# Altium project The_real_mainboar.PrjPcb
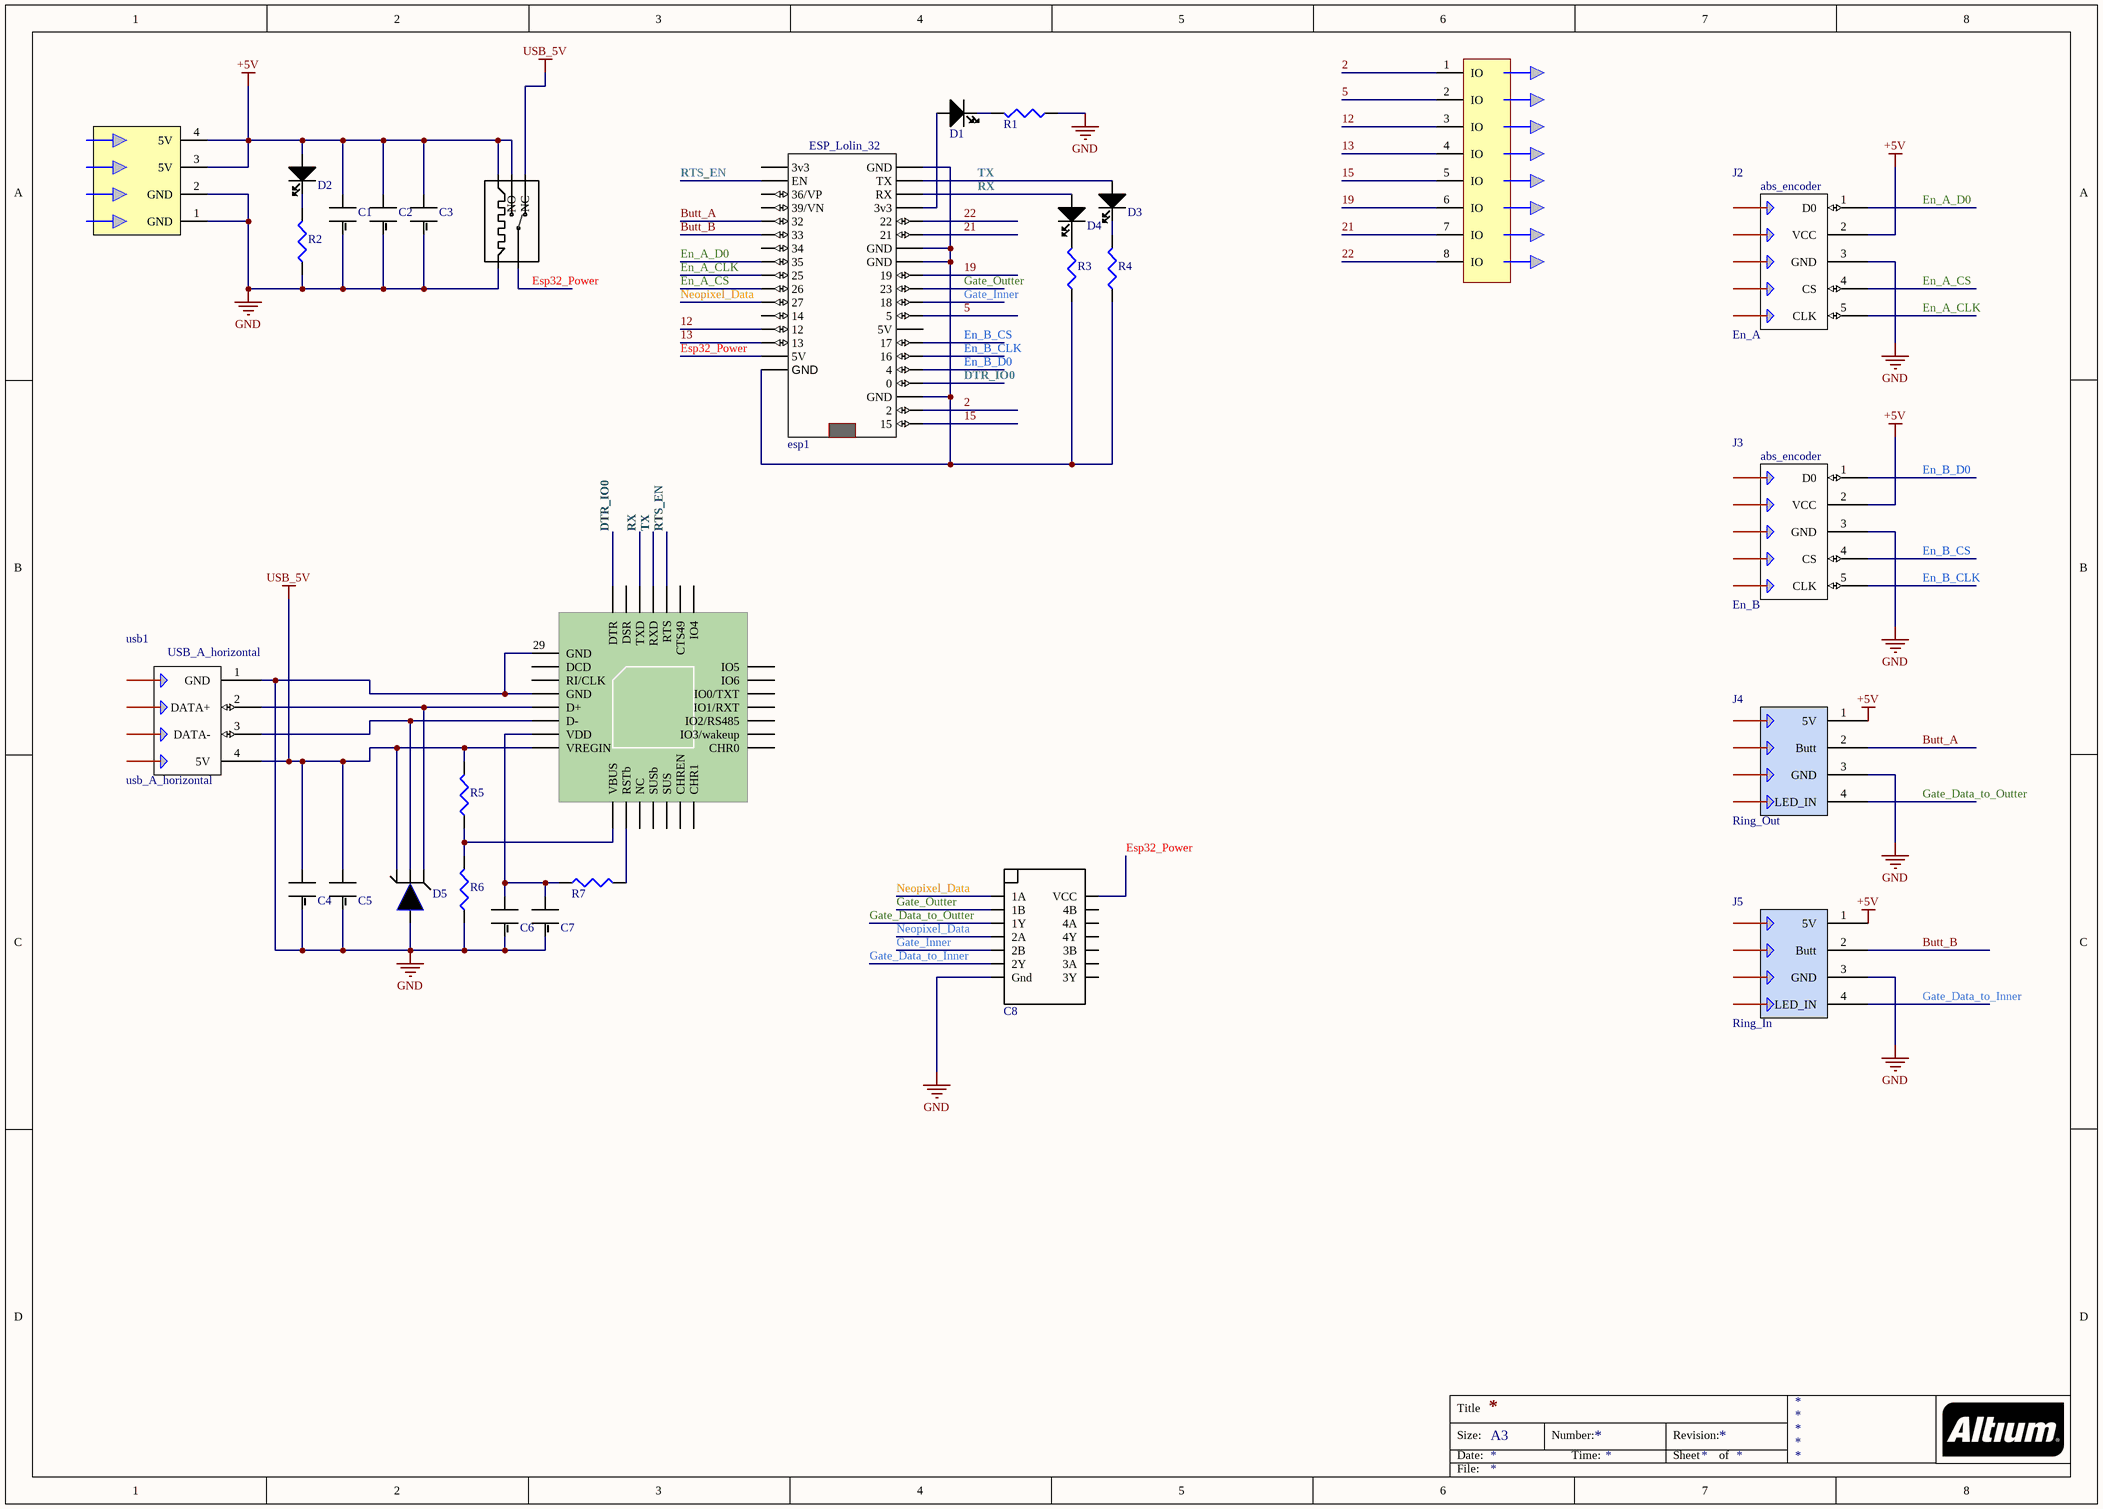
[diagram p0: TheRealMainboardSCH.SchDoc]
1 sheet, 30 parts. Net scope: global (net labels, ports and power ports of the same name join across sheets).
Board file: TheRealMainboardPCB.PcbDoc

## Sheet TheRealMainboardSCH.SchDoc
size A3

### Parts
C1  EEU-FM0J331  [2.5mmCapacitor]  (value not drawn)
C2  EEU-FM0J331  [2.5mmCapacitor]  (value not drawn)
C3  EEU-FM0J331  [2.5mmCapacitor]  (value not drawn)
C4  C4R7  [Capacitor0603]  (value not drawn)
C5  C104  [Capacitor0603]  (value not drawn)
C6  C104  [Capacitor0603]  (value not drawn)
C7  C4R7  [Capacitor0603]  (value not drawn)
C8  74hc08d  [SOP14(74hc08d)]  (value not drawn)
cp1  CP2102N  [CP2102N_QFN28]  (value not drawn)
D1  ESP  [LED0603]  (value not drawn)
D2  P_on  [LED0603]  (value not drawn)
D3  TXD  [LED0603]  (value not drawn)
D4  RXD  [LED0603]  (value not drawn)
D5  SP0503BAHTG  [SP0503BAHTG - SOT143-4]  (value not drawn)
esp1  processor  [ESP_32_socket]  (value not drawn)
J1  4.2mm 4pin 39300040  [4.2mm 4pos]  (value not drawn)
J2  En_A  [xh 2.54 5 pin]
J3  En_B  [xh 2.54 5 pin]
J4  Ring_Out  [XH 2.54 4 PIN]
J5  Ring_In  [XH 2.54 4 PIN]
j6  1x8 dupont io pins  [1x8 dupont]  (value not drawn)
R1  360R  [R0805]  (value not drawn)
R2  R360  [R0805]  (value not drawn)
R3  R360  [R0805]  (value not drawn)
R4  R360  [R0805]  (value not drawn)
R5  R2212  [R0805]  (value not drawn)
R6  R4752  [R0805]  (value not drawn)
R7  R102  [R0805]  (value not drawn)
Relay1  Omron_G5v_dc5  [G5v1_5vdc]  (value not drawn)
usb1  usb_A_horizontal  [HORIZONTAL_USB_A_MALE_SOCKET]

### Nets
+5V: C1.2(+) C2.2(+) C3.2(+) D2.2 J1.3(5V) J1.4(5V) J2.2(VCC) J3.2(VCC) J4.1(5V) J5.1(5V) Relay1.1(Coli_A) Relay1.5(NO)
GND: C1.1(-) C2.1(-) C3.1(-) C4.1(-) C5.1(-) C6.1(-) C7.1(-) C8.7(Gnd) cp1.3(GND) cp1.29(GND) D5.1(+) J1.1(GND) J1.2(GND) J2.3(GND) J3.3(GND) J4.3(GND) J5.3(GND) R1.1 R2.1 R6.1 Relay1.2(Coli_B) usb1.1(GND)
USB_5V: C4.2(+) C5.2(+) cp1.7(VREGIN) D5.4 R5.2 Relay1.4(NC) usb1.4(5V)
2: esp1.19(2) j6.1(IO)
5: esp1.12(5) j6.2(IO)
12: esp1.33(12) j6.3(IO)
13: esp1.34(13) j6.4(IO)
15: esp1.20(15) j6.5(IO)
19: esp1.9(19) j6.6(IO)
21: esp1.6(21) j6.7(IO)
22: esp1.5(22) j6.8(IO)
Butt_A: esp1.25(32) J4.2(Butt)
Butt_B: esp1.26(33) J5.2(Butt)
DTR_IO0: cp1.28(DTR) esp1.17(0)
En_A_CLK: esp1.29(25) J2.5(CLK)
En_A_CS: esp1.30(26) J2.4(CS)
En_A_D0: esp1.28(35) J2.1(D0)
En_B_CLK: esp1.15(16) J3.5(CLK)
En_B_CS: esp1.14(17) J3.4(CS)
En_B_D0: esp1.16(4) J3.1(D0)
Esp32_Power: C8.14(VCC) esp1.35(5V) Relay1.3(COM)
Gate_Data_to_Inner: C8.6(2Y) J5.4(LED_IN)
Gate_Data_to_Outter: C8.3(1Y) J4.4(LED_IN)
Gate_Inner: C8.5(2B) esp1.11(18)
Gate_Outter: C8.2(1B) esp1.10(23)
Neopixel_Data: C8.1(1A) C8.4(2A) esp1.31(27)
RTS_EN: cp1.24(RTS) esp1.22(EN)
RX: cp1.26(TXD) D4.2 esp1.3(RX)
TX: cp1.25(RXD) D3.2 esp1.2(TX)
NetC6_2: C6.2(+) C7.2(+) cp1.6(VDD) R7.1
Netcp1_4: cp1.4(D+) D5.2 usb1.2(DATA+)
Netcp1_5: cp1.5(D-) D5.3 usb1.3(DATA-)
Netcp1_8: cp1.8(VBUS) R5.1 R6.2
Netcp1_9: cp1.9(RSTb) R7.2
NetD1_1: D1.1 R1.2
NetD1_2: D1.2 esp1.4(3v3)
NetD2_1: D2.1 R2.2
NetD3_1: D3.1 R4.2
NetD4_1: D4.1 R3.2
Netesp1_1: esp1.1(GND) esp1.7(GND) esp1.8(GND) esp1.18(GND) esp1.36(GND) R3.1 R4.1

Not connected (* = marked no-connect by the designer): C8 8(3Y) 9(3A) 10(3B) 11(4Y) 12(4A) 13(4B); cp1 1(DCD) 2(RI/CLK) 10(NC) 11(SUSb) 12(SUS) 13(CHREN) 14(CHR1) 15(CHR0) 16(IO3/wakeup) 17(IO2/RS485) 18(IO1/RXT) 19(IO0/TXT) 20(IO6) 21(IO5) 22(IO4) 23(CTS49) 27(DSR); esp1 13(5V) 21(3v3) 23(36/VP) 24(39/VN) 27(34) 32(14)

### Notes on the sheet
- Title
- Size:
- Date:
- A3
- Number:
- Time:
- Revision:
- Sheet
- of
- File:
- (in symbol Abs_encoder_pins) abs_encoder
- (in symbol ESP_32_lolin) ESP_Lolin_32
- (in symbol usb_A_horizontal) USB_A_horizontal

### Library data of the parts
C1-C3 = EEU-FM0J331: Cap 330 uF;  Tol 20%;  Vol-Rtg 6.3 VDC;  Radial;  6.3x11.2;  Bulk; Manufacturer 1: Panasonic; Dielectric Material: Aluminium; Ripple Current (AC): 455mA; Capacitance: 330uF; Voltage Rating: 6.3V; Impedance: 130mR; Life (Hours): 2000Hour; Leakage Current: 10nA; Lead Length: 17mm; Lead Diameter: 0.5mm; Outside Diameter: 6mm; Supplier 1: Digi-Key; Manufacturer Part Number 1: EEU-FM0J331; RoHS: Yes; Category: Aluminum Electrolytic Capacitors; Stock 1: 15455; Pricing 1: 1=0.30000, 10=0.21200, 50=0.14800, 100=0.12690, 500=0.09518, 1000=0.08037, 2500=0.07614, 5000=0.07191 (USD); Mount: Through Hole,PCB; Case/Package: Radial; Number of Pins: 2; Min Operating Temperature: -40°C; Max Operating Temperature: 105°C; Packaging: Bulk; Tolerance: 20%; Ripple Current: 455mA; Package Quantity: 200; ESR (Equivalent Series Resistance): 130mR; Voltage Rating (DC): 6.3V; Termination: Radial; Voltage: 6.3V; Diameter: 6mm; Length: 11.2mm; Height: 11.2mm; Lead Pitch: 2.5mm; Height - Seated (Max): 0.5inch; Radiation Hardening: No; Lead Free: Lead Free; REACH SVHC: No SVHC; ComponentLink1URL: https://datasheet.ciiva.com/11778/0900766b805f3abe-11778876.pdf?src-supplier=RSComponents; ComponentLink1Description: https://datasheet.ciiva.com/11778/0900766b805f3abe-11778876.pdf?src-supplier=RSComponents; ComponentLink2URL: https://datasheet.ciiva.com/92/aba0000ce108-92408.pdf?src-supplier=Digi-Key; ComponentLink2Description: https://datasheet.ciiva.com/92/aba0000ce108-92408.pdf?src-supplier=Digi-Key; ComponentLink3URL: https://datasheet.ciiva.com/30086/aba0000ce108-30086253.pdf?src-supplier=Onlinecomponents.com; ComponentLink3Description: https://datasheet.ciiva.com/30086/aba0000ce108-30086253.pdf?src-supplier=Onlinecomponents.com; ComponentLink4URL: https://datasheet.ciiva.com/16432/aba0000ce108-16432949.pdf?src-supplier=Future+Electronics; ComponentLink4Description: https://datasheet.ciiva.com/16432/aba0000ce108-16432949.pdf?src-supplier=Future+Electronics; ComponentLink5URL: https://datasheet.ciiva.com/46441/26036-46441017.pdf?src-supplier=Element14; ComponentLink5Description: https://datasheet.ciiva.com/46441/26036-46441017.pdf?src-supplier=Element14; ComponentLink6URL: https://datasheet.ciiva.com/14608/70068540-14608622.pdf?src-supplier=Allied+Electronics; ComponentLink6Description: https://datasheet.ciiva.com/14608/70068540-14608622.pdf?src-supplier=Allied+Electronics; Supplier Part Number 1: P12918-ND
C4 = capacitor0603: Cap Ceramic 4.7uF 6.3V X5R 20% Pad SMD 0402 85C T/R; Manufacturer 1: Murata; Manufacturer Part Number 1: GRM155R60J475ME87J; Supplier 1: Digi-Key; RoHS: No; Category: Ceramic Capacitors; Stock 1: 206568; Pricing 1: 1=0.16000, 10=0.11100, 50=0.06280, 100=0.05210, 500=0.03654, 1000=0.03025, 2500=0.02815, 5000=0.02575 (USD); Capacitance: 4.7uF; Tolerance: 20%; Dielectric: X5R; Voltage Rating (DC): 6.3V; Length: 1mm; Thickness: 500um; Width: 500um; ComponentLink1URL: https://search.murata.co.jp/Ceramy/image/img/A01X/G101/ENG/GRM155R60J475ME87-01.pdf?src-supplier=Digi-Key; ComponentLink1Description: https://search.murata.co.jp/Ceramy/image/img/A01X/G101/ENG/GRM155R60J475ME87-01.pdf?src-supplier=Digi-Key; Supplier Part Number 1: 490-18211-1-ND
C5 = capacitor0603: 0.1uf; Manufacturer 1: Murata; Manufacturer Part Number 1: GRM155R60J475ME87J; Capacitance: 4.7uF; Tolerance: 20%; Dielectric: X5R; Voltage Rating (DC): 6.3V; Supplier 1: Digi-Key; RoHS: No; Category: Ceramic Capacitors; Stock 1: 206568; Pricing 1: 1=0.16000, 10=0.11100, 50=0.06280, 100=0.05210, 500=0.03654, 1000=0.03025, 2500=0.02815, 5000=0.02575 (USD); Length: 1mm; Thickness: 500um; Width: 500um; ComponentLink1URL: https://search.murata.co.jp/Ceramy/image/img/A01X/G101/ENG/GRM155R60J475ME87-01.pdf?src-supplier=Digi-Key; ComponentLink1Description: https://search.murata.co.jp/Ceramy/image/img/A01X/G101/ENG/GRM155R60J475ME87-01.pdf?src-supplier=Digi-Key; Supplier Part Number 1: 490-18211-1-ND
C6 = capacitor0603: 4.7; Manufacturer 1: Murata; Manufacturer Part Number 1: GRM155R60J475ME87J; Capacitance: 4.7uF; Tolerance: 20%; Dielectric: X5R; Voltage Rating (DC): 6.3V; Supplier 1: Digi-Key; RoHS: No; Category: Ceramic Capacitors; Stock 1: 206568; Pricing 1: 1=0.16000, 10=0.11100, 50=0.06280, 100=0.05210, 500=0.03654, 1000=0.03025, 2500=0.02815, 5000=0.02575 (USD); Length: 1mm; Thickness: 500um; Width: 500um; ComponentLink1URL: https://search.murata.co.jp/Ceramy/image/img/A01X/G101/ENG/GRM155R60J475ME87-01.pdf?src-supplier=Digi-Key; ComponentLink1Description: https://search.murata.co.jp/Ceramy/image/img/A01X/G101/ENG/GRM155R60J475ME87-01.pdf?src-supplier=Digi-Key; Supplier Part Number 1: 490-18211-1-ND
C7 = capacitor0603: 0.1; Manufacturer 1: Murata; Manufacturer Part Number 1: GRM155R60J475ME87J; Capacitance: 4.7uF; Tolerance: 20%; Dielectric: X5R; Voltage Rating (DC): 6.3V; Supplier 1: Digi-Key; RoHS: No; Category: Ceramic Capacitors; Stock 1: 206568; Pricing 1: 1=0.16000, 10=0.11100, 50=0.06280, 100=0.05210, 500=0.03654, 1000=0.03025, 2500=0.02815, 5000=0.02575 (USD); Length: 1mm; Thickness: 500um; Width: 500um; ComponentLink1URL: https://search.murata.co.jp/Ceramy/image/img/A01X/G101/ENG/GRM155R60J475ME87-01.pdf?src-supplier=Digi-Key; ComponentLink1Description: https://search.murata.co.jp/Ceramy/image/img/A01X/G101/ENG/GRM155R60J475ME87-01.pdf?src-supplier=Digi-Key; Supplier Part Number 1: 490-18211-1-ND
C8 = 74HC08: ComponentLink1Description: 4 2-input and gate; ComponentLink1URL: https://pdf1.alldatasheet.com/datasheet-pdf/view/646498/PHILIPS/74HC08D.html
cp1 = CP2102N-A02-GQFN28R: Full Speed USB to UART Bridge USB 2.0 3.3V T/R Automotive 28-Pin QFN EP; Manufacturer 1: Silicon Labs; Supplier 1: Digi-Key; Manufacturer Part Number 1: CP2102N-A02-GQFN28R; RoHS: No; Stock 1: 1682; Pricing 1: 1=1.40000, 25=1.35160, 100=1.29950 (USD); Supplier Part Number 1: 336-5890-1-ND
D1-D4 = LTST-C190TBKT: LED BLUE CLEAR CHIP SMD; Manufacturer 1: Vishay Lite-On; Lens Color: Colorless; Viewing Angle: 130°; Forward Voltage: 3.8V; Lens Style: Diffused,Colorless,Clear,Rectangular; Luminous Intensity: 180mcd; Forward Current: 20mA; Dominant Wavelength: 475nm; Number of Elements: 1; Power Dissipation: 76mW; Wavelength: 468nm; Reverse Voltage: 5V; Supplier 1: Digi-Key; Manufacturer Part Number 1: LTST-C190TBKT; RoHS: Yes; Category: LEDs; Stock 1: 76203; Pricing 1: 1=0.50000, 10=0.35600, 100=0.15840, 500=0.11088, 1000=0.09108 (USD); Mount: Surface Mount; Case/Package: 0603; Number of Pins: 2; Color: Blue; Case Code (Metric): 1608; Case Code (Imperial): 0603; Min Operating Temperature: -20°C; Max Operating Temperature: 80°C; Packaging: Tape and Reel; Package Quantity: 1; Illumination Color: Blue; Test Current: 20mA; Lens Transparency: Clear; Number of LEDs: 1; Length: 1.6mm; Height: 0.8mm; Width: 0.8mm; Depth: 0.8mm; Radiation Hardening: No; Lead Free: Lead Free; ComponentLink1URL: https://datasheet.ciiva.com/16353/lite-on20ltst-c190tbkt-16353409.pdf?src-supplier=Future+Electronics; ComponentLink1Description: https://datasheet.ciiva.com/16353/lite-on20ltst-c190tbkt-16353409.pdf?src-supplier=Future+Electronics; ComponentLink2URL: https://datasheet.ciiva.com/15117/getdatasheetpartid-131310-15117667.pdf?src-supplier=Verical; ComponentLink2Description: https://datasheet.ciiva.com/15117/getdatasheetpartid-131310-15117667.pdf?src-supplier=Verical; ComponentLink3URL: https://datasheet.ciiva.com/2110/ltst-c190tbkt-2110473.pdf?src-supplier=Digi-Key; ComponentLink3Description: https://datasheet.ciiva.com/2110/ltst-c190tbkt-2110473.pdf?src-supplier=Digi-Key; ComponentLink4URL: https://datasheet.ciiva.com/12400/lite-on-ltst-c190tbkt-187381-12400873.pdf?src-supplier=Mouser; ComponentLink4Description: https://datasheet.ciiva.com/12400/lite-on-ltst-c190tbkt-187381-12400873.pdf?src-supplier=Mouser; ComponentLink5URL: https://datasheet.ciiva.com/11774/0900766b80dc02ab-11774378.pdf?src-supplier=RSComponents; ComponentLink5Description: https://datasheet.ciiva.com/11774/0900766b80dc02ab-11774378.pdf?src-supplier=RSComponents; ComponentLink6URL: https://datasheet.ciiva.com/26913/ltst-c190tbkt-26913716.pdf?src-supplier=IIIC; ComponentLink6Description: https://datasheet.ciiva.com/26913/ltst-c190tbkt-26913716.pdf?src-supplier=IIIC; ComponentLink7URL: https://datasheet.ciiva.com/2110/s-110-ltst-c190tbkt0630-2110475.pdf?src-supplier=Digi-Key; ComponentLink7Description: https://datasheet.ciiva.com/2110/s-110-ltst-c190tbkt0630-2110475.pdf?src-supplier=Digi-Key; ComponentLink8Description: 橘色的; ComponentLink8URL: https://www.digikey.tw/product-detail/zh/lite-on-inc/LTST-C191KFKT/160-1445-1-ND/386832
D5 = SP0503BAHTG: ESD Suppressor TVS 5.5V 4-Pin(3+Tab) SOT-143 T/R; Manufacturer 1: Littelfuse; Element Configuration: Common Anode; Direction: Unidirectional; Capacitance: 30pF; Number of Channels: 3; Clamping Voltage: 8.5V; Power Line Protection: No; Polarity: Bidirectional,Unidirectional; Max Power Dissipation: 225mW; ESD Protection: Yes; Max Reverse Leakage Current: 100nA; Voltage Rating (DC): 5V; Diode Type: Avalanche; Supplier 1: Digi-Key; Manufacturer Part Number 1: SP0503BAHTG; RoHS: Yes; Category: Diodes; Stock 1: 63906; Pricing 1: 1=0.80000, 10=0.66000, 100=0.51120, 500=0.38340, 1000=0.30885 (USD); Mount: Surface Mount; Case/Package: SOT-143; Number of Pins: 4; Min Operating Temperature: -40°C; Max Operating Temperature: 85°C; Operating Supply Voltage: 5.5V; Packaging: Tape and Reel; Number of Unidirectional Channels: 3; Reverse Standoff Voltage: 5.5V; Breakdown Voltage: 5.5V; Termination: SMD/SMT; Working Voltage: 5.5V; Peak Pulse Power: 225mW; Leakage Current: 100nA; Number of Elements: 3; Power Dissipation: 225mW; Resistor Type: Zener; Length: 3.04mm; Height: 1.05mm; Width: 1.4mm; Depth: 1.4mm; Radiation Hardening: No; REACH SVHC: No SVHC; Lead Free: Lead Free; ComponentLink1URL: https://datasheet.ciiva.com/15143/getdatasheetpartid-116020-15143550.pdf?src-supplier=Verical; ComponentLink1Description: https://datasheet.ciiva.com/15143/getdatasheetpartid-116020-15143550.pdf?src-supplier=Verical; ComponentLink2URL: https://datasheet.ciiva.com/332/sp05xxba-332550.pdf?src-supplier=Digi-Key; ComponentLink2Description: https://datasheet.ciiva.com/332/sp05xxba-332550.pdf?src-supplier=Digi-Key; ComponentLink3URL: https://datasheet.ciiva.com/8062/littefuse-spa-sp050x-8062422.pdf?src-supplier=Element14; ComponentLink3Description: https://datasheet.ciiva.com/8062/littefuse-spa-sp050x-8062422.pdf?src-supplier=Element14; ComponentLink4URL: https://datasheet.ciiva.com/22697/1911798-22697942.pdf?src-supplier=Element14; ComponentLink4Description: https://datasheet.ciiva.com/22697/1911798-22697942.pdf?src-supplier=Element14; ComponentLink5URL: https://datasheet.ciiva.com/332/sp05xxba-332551.pdf?src-supplier=Digi-Key; ComponentLink5Description: https://datasheet.ciiva.com/332/sp05xxba-332551.pdf?src-supplier=Digi-Key; ComponentLink6URL: https://datasheet.ciiva.com/16449/sp05xxba-16449463.pdf?src-supplier=Future+Electronics; ComponentLink6Description: https://datasheet.ciiva.com/16449/sp05xxba-16449463.pdf?src-supplier=Future+Electronics; ComponentLink7URL: https://datasheet.ciiva.com/332/sp05xxba-332552.pdf?src-supplier=Digi-Key; ComponentLink7Description: https://datasheet.ciiva.com/332/sp05xxba-332552.pdf?src-supplier=Digi-Key; ComponentLink8URL: https://datasheet.ciiva.com/4509/sp05x-leadfree-4509162.pdf?src-supplier=Mouser; ComponentLink8Description: https://datasheet.ciiva.com/4509/sp05x-leadfree-4509162.pdf?src-supplier=Mouser; ComponentLink9URL: https://datasheet.ciiva.com/7650/526672-7650894.pdf?src-supplier=Element14; ComponentLink9Description: https://datasheet.ciiva.com/7650/526672-7650894.pdf?src-supplier=Element14; Supplier Part Number 1: F2715CT-ND
esp1 = ESP_32_lolin
J1 = 4.2mm 4pin 39300040: for neopixels array; Manufacturer 1: Molex; Number of Terminals/Pins: 4; Connector Type: Header,Male Pin; Number of Ports: 1; Gender: Male; Contact Resistance: 10mR; Row Spacing: 0.165inch; Supplier 1: Digi-Key; Manufacturer Part Number 1: 39-29-1048; RoHS: Yes; Category: Headers and Wire Housings; Stock 1: 1264; Pricing 1: 1=0.89000, 10=0.78000, 100=0.67300, 500=0.55062, 1000=0.48944, 5000=0.42826, 10000=0.40685 (USD); Mount: Through Hole; Contact Shape: Square; Insulation Material: Nylon; Insulation Color: Natural; Housing Material: Nylon; Housing Color: Natural; Contact Material: Brass; Contact Plating: Tin,Copper; Color: Natural; Min Operating Temperature: -40°C; Max Operating Temperature: 105°C; Packaging: Bulk; Number of Positions: 4; Termination: Solder; Number of Contacts: 4; Orientation: Right Angle; Number of Rows: 2; Fastening Type: Ramp; Length: 19.6mm; Pitch: 4.2mm; Depth: 19.4mm; Flammability Rating: UL94 V-2; Supplier Part Number 1: WM3901-ND; ComponentLink7Description: realdatasheet; ComponentLink7URL: https://www.molex.com/pdm_docs/sd/039300040_sd.pdf
J2 J3 = Abs_encoder_pins: ComponentLink1Description: datasheet; ComponentLink1URL: http://www.jst-mfg.com/product/pdf/eng/eXH.pdf
J4 J5 = To_rings_connector
R1 = CRCW0805360RFKEA: Res Thick Film 0805 360 Ohm 1% 0.125W(1/8W) ±100ppm/C Molded SMD Automotive Paper T/R; Manufacturer 1: Vishay; Temperature Coefficient: 100ppm/°C; Max Power Dissipation: 125mW; Voltage Rating (DC): 150V; Supplier 1: Digi-Key; Manufacturer Part Number 1: CRCW0805360RFKEA; RoHS: Yes; Category: Chip SMD Resistors; Stock 1: 25005; Pricing 1: 1=0.10000, 10=0.06000, 100=0.02450, 1000=0.01102, 2500=0.00957 (USD); Case/Package: 0805; Number of Pins: 2; Weight: 0.000194oz; Case Code (Metric): 2012; Case Code (Imperial): 0805; Contact Plating: Tin; Number of Terminals: 2; Min Operating Temperature: -55°C; Max Operating Temperature: 155°C; Resistance: 360R; Tolerance: 1%; Packaging: Tape and Reel; Composition: Thick Film; Package Quantity: 10; Number of Terminations: 2; Features: Automotive AEC-Q200; Power Rating: 125mW; Voltage Rating: 150V; Termination: SMD/SMT; Military Standard: Not; Length: 2mm; Height: 0.45mm; Width: 0.049inch; Depth: 1.25mm; Radiation Hardening: No; Lead Free: Lead Free; REACH SVHC: Unknown; ComponentLink1URL: https://datasheet.ciiva.com/2467/dcrcwe3-2467773.pdf?src-supplier=Digi-Key; ComponentLink1Description: https://datasheet.ciiva.com/2467/dcrcwe3-2467773.pdf?src-supplier=Digi-Key; Supplier Part Number 1: 541-360CCT-ND
R2-R4 = CRCW0805360RFKEA: Res Thick Film 0805 360 Ohm 1% 0.125W(1/8W) ±100ppm/C Molded SMD Automotive Paper T/R; Manufacturer 1: Vishay; Resistance: 360R; Temperature Coefficient: 100ppm/°C; Max Power Dissipation: 125mW; Voltage Rating (DC): 150V; Supplier 1: Digi-Key; Manufacturer Part Number 1: CRCW0805360RFKEA; RoHS: Yes; Category: Chip SMD Resistors; Stock 1: 25005; Pricing 1: 1=0.10000, 10=0.06000, 100=0.02450, 1000=0.01102, 2500=0.00957 (USD); Case/Package: 0805; Number of Pins: 2; Weight: 0.000194oz; Case Code (Metric): 2012; Case Code (Imperial): 0805; Contact Plating: Tin; Number of Terminals: 2; Min Operating Temperature: -55°C; Max Operating Temperature: 155°C; Tolerance: 1%; Packaging: Tape and Reel; Composition: Thick Film; Package Quantity: 10; Number of Terminations: 2; Features: Automotive AEC-Q200; Power Rating: 125mW; Voltage Rating: 150V; Termination: SMD/SMT; Military Standard: Not; Length: 2mm; Height: 0.45mm; Width: 0.049inch; Depth: 1.25mm; Radiation Hardening: No; Lead Free: Lead Free; REACH SVHC: Unknown; ComponentLink1URL: https://datasheet.ciiva.com/2467/dcrcwe3-2467773.pdf?src-supplier=Digi-Key; ComponentLink1Description: https://datasheet.ciiva.com/2467/dcrcwe3-2467773.pdf?src-supplier=Digi-Key; Supplier Part Number 1: 541-360CCT-ND
R5 R6 = resistor(CRCW0805360RFKEA: Res Thick Film 0805 360 Ohm 1% 0.125W(1/8W) ±100ppm/C Molded SMD Automotive Paper T/R; Manufacturer 1: Vishay; Resistance: 360R; Temperature Coefficient: 100ppm/°C; Max Power Dissipation: 125mW; Voltage Rating (DC): 150V; Supplier 1: Digi-Key; Manufacturer Part Number 1: CRCW0805360RFKEA; RoHS: Yes; Category: Chip SMD Resistors; Stock 1: 25005; Pricing 1: 1=0.10000, 10=0.06000, 100=0.02450, 1000=0.01102, 2500=0.00957 (USD); Case/Package: 0805; Number of Pins: 2; Weight: 0.000194oz; Case Code (Metric): 2012; Case Code (Imperial): 0805; Contact Plating: Tin; Number of Terminals: 2; Min Operating Temperature: -55°C; Max Operating Temperature: 155°C; Tolerance: 1%; Packaging: Tape and Reel; Composition: Thick Film; Package Quantity: 10; Number of Terminations: 2; Features: Automotive AEC-Q200; Power Rating: 125mW; Voltage Rating: 150V; Termination: SMD/SMT; Military Standard: Not; Length: 2mm; Height: 0.45mm; Width: 0.049inch; Depth: 1.25mm; Radiation Hardening: No; Lead Free: Lead Free; REACH SVHC: Unknown; ComponentLink1URL: https://datasheet.ciiva.com/2467/dcrcwe3-2467773.pdf?src-supplier=Digi-Key; ComponentLink1Description: https://datasheet.ciiva.com/2467/dcrcwe3-2467773.pdf?src-supplier=Digi-Key; Supplier Part Number 1: 541-360CCT-ND
R7 = resistor(CRCW0805360RFKEA: 1Kohms; Manufacturer 1: Vishay; Resistance: 360R; Tolerance: 1%; Temperature Coefficient: 100ppm/°C; Max Power Dissipation: 125mW; Voltage Rating (DC): 150V; Supplier 1: Digi-Key; Manufacturer Part Number 1: CRCW0805360RFKEA; RoHS: Yes; Category: Chip SMD Resistors; Stock 1: 25005; Pricing 1: 1=0.10000, 10=0.06000, 100=0.02450, 1000=0.01102, 2500=0.00957 (USD); Case/Package: 0805; Number of Pins: 2; Weight: 0.000194oz; Case Code (Metric): 2012; Case Code (Imperial): 0805; Contact Plating: Tin; Number of Terminals: 2; Min Operating Temperature: -55°C; Max Operating Temperature: 155°C; Packaging: Tape and Reel; Composition: Thick Film; Package Quantity: 10; Number of Terminations: 2; Features: Automotive AEC-Q200; Power Rating: 125mW; Voltage Rating: 150V; Termination: SMD/SMT; Military Standard: Not; Length: 2mm; Height: 0.45mm; Width: 0.049inch; Depth: 1.25mm; Radiation Hardening: No; Lead Free: Lead Free; REACH SVHC: Unknown; ComponentLink1URL: https://datasheet.ciiva.com/2467/dcrcwe3-2467773.pdf?src-supplier=Digi-Key; ComponentLink1Description: https://datasheet.ciiva.com/2467/dcrcwe3-2467773.pdf?src-supplier=Digi-Key; Supplier Part Number 1: 541-360CCT-ND
usb1 = usb_A_horizontal: 4 Position Single Port Socket Right Angle Type A Through Hole USB; Manufacturer 1: TE Connectivity; Manufacturer Part Number 1: 292303-1; Plating: Bright,Tin; Current Rating: 1A; Voltage Rating (AC): 30V; Gender: Receptacle; Number of Ports: 1; Insulation Resistance: 1GR; Number of Contacts: 4; Plating Thickness: 0.76um; USB Standard: USB 2.0; Circuit Application: Signal; Connector System: Cable-to-Board; PCB Thickness: 0.062inch; Tail Length: 0.112inch; Pitch: 2.5mm; Approvals: UL; Supplier 1: Digi-Key; RoHS: Yes; Category: Audio / Video Connectors; Stock 1: 16277; Pricing 1: 1=1.49000, 10=1.35400, 25=1.27160, 50=1.21620, 100=1.16100, 250=1.05040, 500=0.96748, 1000=0.82926, 2500=0.77398 (USD); Mount: Through Hole,Horizontal; Contact Plating: Gold; Contact Material: Copper Alloy,Copper; Color: Black; Number of Terminals: 4; Housing Material: Thermoplastic; Housing Color: Black; Min Operating Temperature: -67°C; Max Operating Temperature: 185°C; Packaging: Rail/Tube; Package Quantity: 30; Connector Type: Receptacle; Termination: Through Hole; Number of Positions: 4; Orientation: Right Angle; Contact Current Rating: 1A; Length: 14.63mm; Depth: 14mm; REACH SVHC: No SVHC; Flammability Rating: UL94 V-0; Halogen Free: Halogen Free; ComponentLink1URL: https://datasheet.ciiva.com/851/eng-cd-292303-e9-851601.pdf?src-supplier=Farnell; ComponentLink1Description: https://datasheet.ciiva.com/851/eng-cd-292303-e9-851601.pdf?src-supplier=Farnell; ComponentLink2URL: https://datasheet.ciiva.com/1099/1653030-1099765.pdf?src-supplier=Newark; ComponentLink2Description: https://datasheet.ciiva.com/1099/1653030-1099765.pdf?src-supplier=Newark; ComponentLink3URL: https://datasheet.ciiva.com/1098/eng-cd-292303-e9-1098298.pdf?src-supplier=Element14; ComponentLink3Description: https://datasheet.ciiva.com/1098/eng-cd-292303-e9-1098298.pdf?src-supplier=Element14; ComponentLink4URL: https://datasheet.ciiva.com/11731/0900766b806d08c4-11731322.pdf?src-supplier=RSComponents; ComponentLink4Description: https://datasheet.ciiva.com/11731/0900766b806d08c4-11731322.pdf?src-supplier=RSComponents; ComponentLink5URL: https://datasheet.ciiva.com/14103/04270708-14103420.pdf?src-supplier=Distrelec; ComponentLink5Description: https://datasheet.ciiva.com/14103/04270708-14103420.pdf?src-supplier=Distrelec; ComponentLink6URL: https://datasheet.ciiva.com/19454/921651-19454494.pdf?src-supplier=Jameco; ComponentLink6Description: https://datasheet.ciiva.com/19454/921651-19454494.pdf?src-supplier=Jameco; ComponentLink7URL: https://datasheet.ciiva.com/16308/eng-cd-292303-e7-16308319.pdf?src-supplier=Future+Electronics; ComponentLink7Description: https://datasheet.ciiva.com/16308/eng-cd-292303-e7-16308319.pdf?src-supplier=Future+Electronics; ComponentLink8URL: https://datasheet.ciiva.com/3094/eng-ds-1-1773453-6-0908-3094357.pdf?src-supplier=Avnet; ComponentLink8Description: https://datasheet.ciiva.com/3094/eng-ds-1-1773453-6-0908-3094357.pdf?src-supplier=Avnet; ComponentLink9URL: https://datasheet.ciiva.com/16468/eng-ds-1-1773453-6-0908-16468232.pdf?src-supplier=Avnet+Asia; ComponentLink9Description: https://datasheet.ciiva.com/16468/eng-ds-1-1773453-6-0908-16468232.pdf?src-supplier=Avnet+Asia; ComponentLink10URL: https://datasheet.ciiva.com/851/eng-cd-292303-e9-851082.pdf?src-supplier=Digi-Key; ComponentLink10Description: https://datasheet.ciiva.com/851/eng-cd-292303-e9-851082.pdf?src-supplier=Digi-Key; ComponentLink11URL: https://datasheet.ciiva.com/8016/1653030-8016986.pdf?src-supplier=Element14; ComponentLink11Description: https://datasheet.ciiva.com/8016/1653030-8016986.pdf?src-supplier=Element14; ComponentLink12URL: https://datasheet.ciiva.com/14618/70041246-14618698.pdf?src-supplier=Allied+Electronics; ComponentLink12Description: https://datasheet.ciiva.com/14618/70041246-14618698.pdf?src-supplier=Allied+Electronics; ComponentLink13URL: https://datasheet.ciiva.com/25907/eng-ds-1-1773453-6-0908-25907515.pdf?src-supplier=Avnet+Europe; ComponentLink13Description: https://datasheet.ciiva.com/25907/eng-ds-1-1773453-6-0908-25907515.pdf?src-supplier=Avnet+Europe; ComponentLink14URL: https://datasheet.ciiva.com/30148/ddecontrolleractionsrchrtrvdocnm117734536doctypedsdoclan-30148862.pdf?src-supplier=Onlinecomponents.com; ComponentLink14Description: https://datasheet.ciiva.com/30148/ddecontrolleractionsrchrtrvdocnm117734536doctypedsdoclan-30148862.pdf?src-supplier=Onlinecomponents.com; Supplier Part Number 1: A31726-ND
Relay1 = Omron_G5v_dc5: ComponentLink1Description: datasheed_be_aware of pin; ComponentLink1URL: https://omronfs.omron.com/en_US/ecb/products/pdf/en-g5v_1.pdf